# EAGLE design receiver (EAGLE 7.2.0)
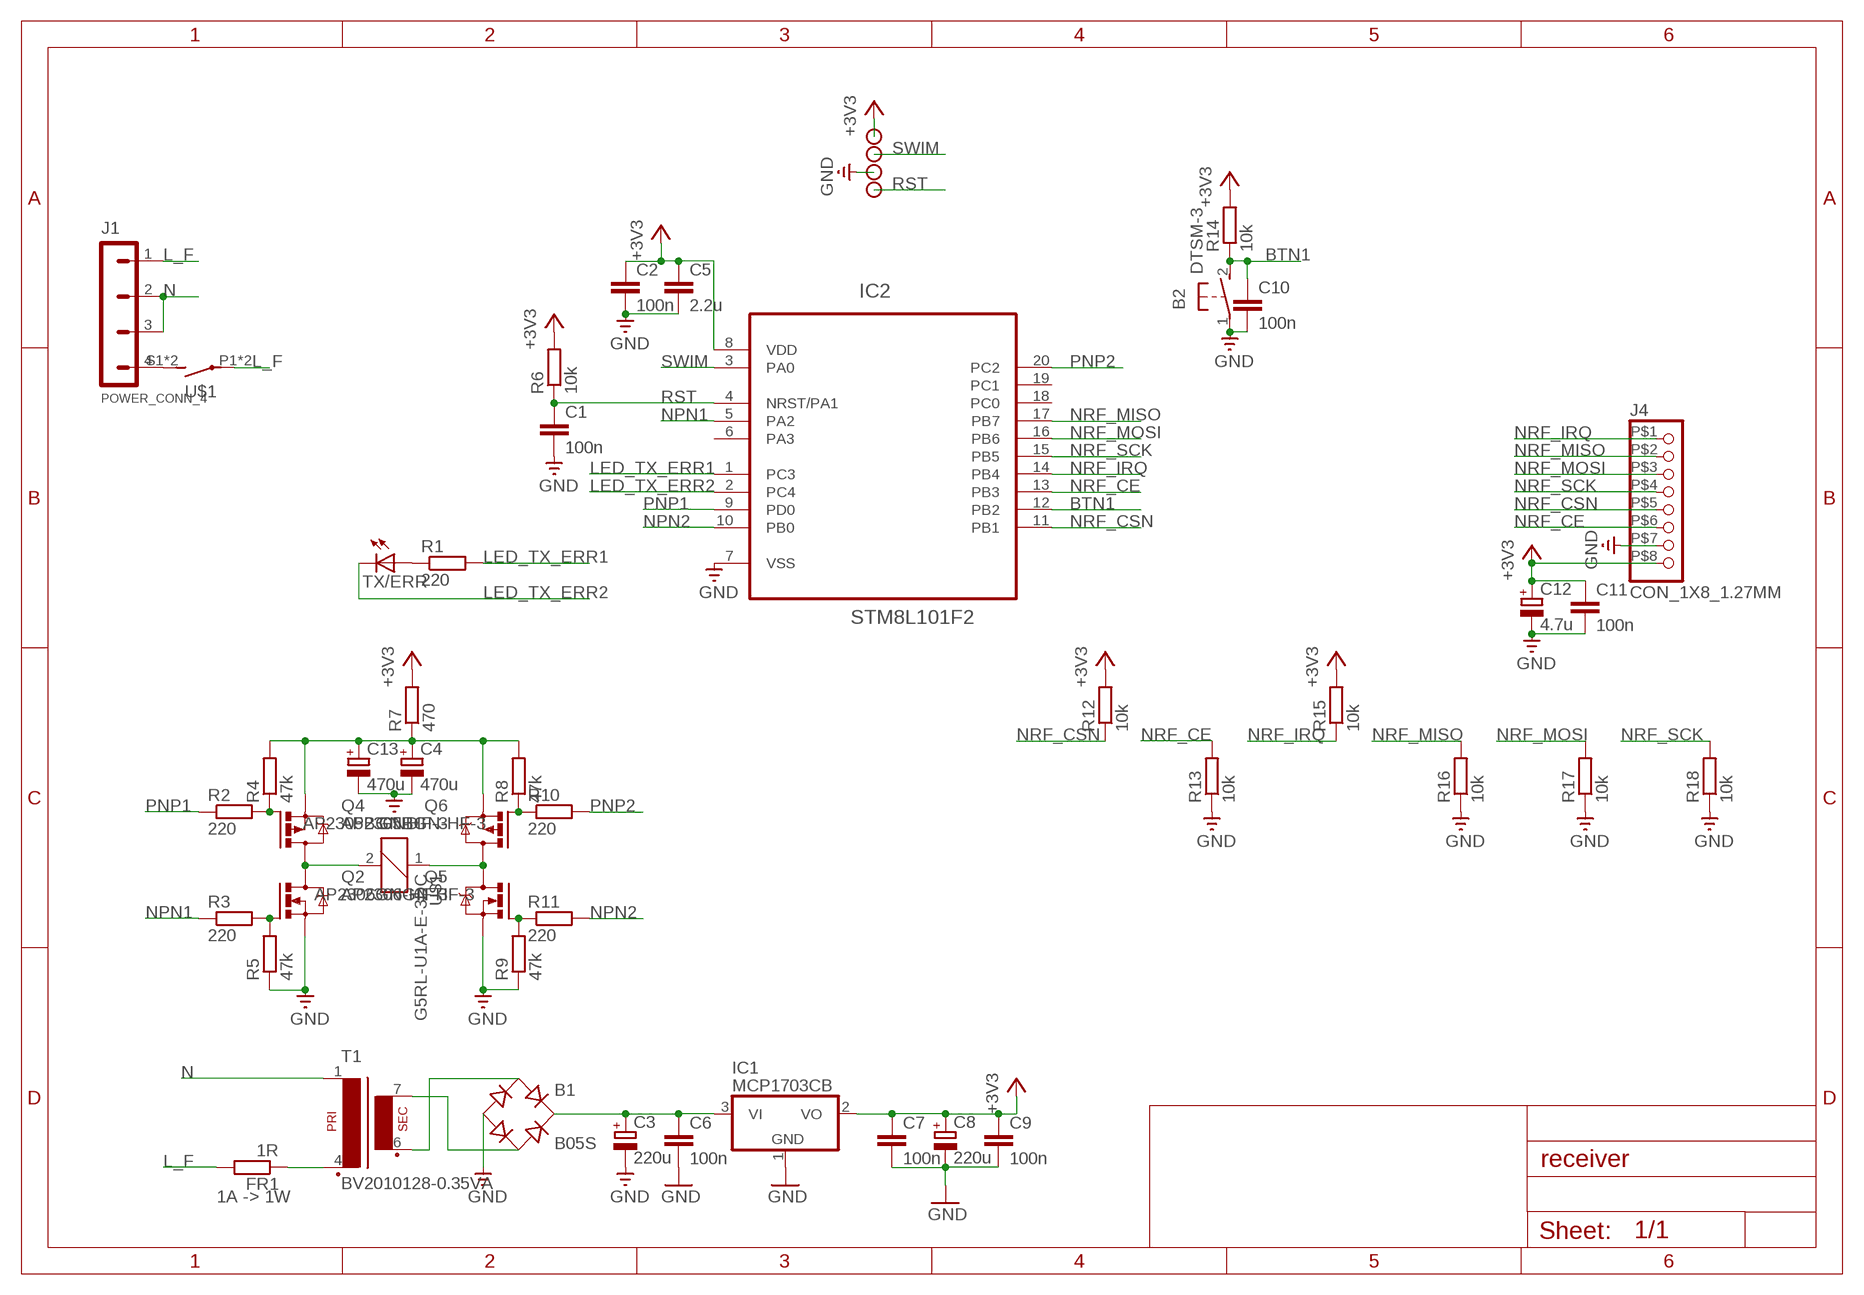
[diagram p0: schematic, sheet 1]

## Parts
B1  B05S  [MBS]
B2  DTSM-3  [DTSM-3]
C1  100n  C-EUC0603K  [C0603K]
C2  100n  C-EUC0603K  [C0603K]
C3  220u  CPOL-EUE3.5-8  [E3,5-8]
C4  470u  CPOL-EUE2.5-6  [E2,5-6]
C5  2.2u  C-EUC0805K  [C0805K]
C6  100n  C-EUC0603K  [C0603K]
C7  100n  C-EUC0603K  [C0603K]
C8  220u  CPOL-EUE2.5-6  [E2,5-6]
C9  100n  C-EUC0603K  [C0603K]
C10  100n  C-EUC0603K  [C0603K]
C11  100n  C-EUC0603K  [C0603K]
C12  4.7u  CPOL-EUSMCA  [SMC_A]
C13  470u  CPOL-EUE2.5-6  [E2,5-6]
FR1  1R  R-EU_0309/10  [0309/10]
IC1  MCP1703CB  [SOT23]
IC2  STM8L101F2  [TSSOP20]
J1  POWER_CONN_4  [TERMINAL_BLOCK_4]
J4  CON_1X8_1.27MM  [CON_1X8PIN_1.27MM]
Q2  AP2306GN-HF-3  [SOT23]
Q4  AP2305BGN-HF-3  [SOT23]
Q5  AP2306GN-HF-3  [SOT23]
Q6  AP2305BGN-HF-3  [SOT23]
R1  220  R-EU_R0603  [R0603]
R2  220  R-EU_R0603  [R0603]
R3  220  R-EU_R0603  [R0603]
R4  47k  R-EU_R0603  [R0603]
R5  47k  R-EU_R0603  [R0603]
R6  10k  R-EU_R0603  [R0603]
R7  470  R-EU_R0603  [R0603]
R8  47k  R-EU_R0603  [R0603]
R9  47k  R-EU_R0603  [R0603]
R10  220  R-EU_R0603  [R0603]
R11  220  R-EU_R0603  [R0603]
R12  10k  R-EU_R0603  [R0603]
R13  10k  R-EU_R0603  [R0603]
R14  10k  R-EU_R0603  [R0603]
R15  10k  R-EU_R0603  [R0603]
R16  10k  R-EU_R0603  [R0603]
R17  10k  R-EU_R0603  [R0603]
R18  10k  R-EU_R0603  [R0603]
SIG_+3V1  CON_PAD  [SMD_PAD]
SIG_GND  CON_PAD  [SMD_PAD]
SIG_RST  CON_PAD  [SMD_PAD]
SIG_SWIM  CON_PAD  [SMD_PAD]
T1  BV2010128-0.35VA  [BV2010128-0.35VA]
TX/ERR  LED3MM  [LED3MM]
U$1  G5RL-U1A-E-3DC  [G5RL-U1A-E-3DC]

## Nets
+3V3: C2.1 C5.1 C7.1 C8.+ C9.1 C11.1 C12.+ IC1.2(VO) IC2.8(VDD) J4.P$8 R6.2 R7.2 R12.2 R14.2 R15.2 SIG_+3V1.P$1
BTN1: B2.2 C10.1 IC2.12(PB2) R14.1
GND: B1.- B2.1 C1.2 C2.2 C3.- C4.- C5.2 C6.2 C7.2 C8.- C9.2 C10.2 C11.2 C12.- C13.- IC1.1(GND) IC2.7(VSS) J4.P$7 Q2.2(S) Q5.2(S) R5.1 R9.1 R13.1 R16.1 R17.1 R18.1 SIG_GND.P$1
L_F: FR1.2 J1.1 U$1.P1(P) U$1.P2(P)
LED_TX_ERR1: IC2.1(PC3) R1.2
LED_TX_ERR2: IC2.2(PC4) TX/ERR.K(C)
N: J1.2 J1.3 T1.1
N$1: J1.4 U$1.S1(S) U$1.S2(S)
N$2: R1.1 TX/ERR.A
N$3: B1.AC2 T1.7(S4)
N$4: B1.+ C3.+ C6.1 IC1.3(VI)
N$8: B1.AC1 T1.6(S3)
N$9: Q2.1(G) R3.2 R5.2
N$10: Q2.3(D) Q4.3(D) U$1.2
N$11: Q5.1(G) R9.2 R11.1
N$12: Q4.1(G) R2.2 R4.1
N$14: Q6.1(G) R8.1 R10.1
N$17: Q5.3(D) Q6.3(D) U$1.1
N$18: C4.+ C13.+ Q4.2(S) Q6.2(S) R4.2 R7.1 R8.2
N$19: FR1.1 T1.4(P2)
NPN1: IC2.5(PA2) R3.1
NPN2: IC2.10(PB0) R11.2
NRF_CE: IC2.13(PB3) J4.P$6 R13.2
NRF_CSN: IC2.11(PB1) J4.P$5 R12.1
NRF_IRQ: IC2.14(PB4) J4.P$1 R15.1
NRF_MISO: IC2.17(PB7) J4.P$2 R16.2
NRF_MOSI: IC2.16(PB6) J4.P$3 R17.2
NRF_SCK: IC2.15(PB5) J4.P$4 R18.2
PNP1: IC2.9(PD0) R2.1
PNP2: IC2.20(PC2) R10.2
RST: C1.1 IC2.4(NRST/PA1) R6.1 SIG_RST.P$1
SWIM: IC2.3(PA0) SIG_SWIM.P$1
Unconnected: IC2.6(PA3) IC2.18(PC0) IC2.19(PC1)

## Notes on the sheet
- 1A -> 1W

## Library data of the parts
B1 = rectifier:B*S: Surface Mount Glass Passivated Bridge Rectifiers Source: Comchip Bridge Rectifiers B05S-G_B10S-G.pdf
B2 = switch-tact:DTSM-3
C1 C2 C5-C7 C9-C11 = resistor:C-EU: CAPACITOR, European symbol
C3 C4 C8 C12 C13 = resistor:CPOL-EU: POLARIZED CAPACITOR, European symbol
FR1 R1-R18 = resistor:R-EU_: RESISTOR, European symbol
IC1 = linear:MCP1703: 250 mA, 16V, Low Quiescent Current LDO Regulator Source: http://ww1.microchip.com/downloads/en/DeviceDoc/22049b.pdf
IC2 = componente_RFSwitch:STM8L101F2
J1 = CarReceiver:POWER_CONN_4
J4 = componente_RFSwitch:CON_1X8_1.27MM
Q2 Q5 = componente_RFSwitch:AP2306GN-HF-3
Q4 Q6 = componente_RFSwitch:AP2305BGN-HF-3
SIG_+3V1 SIG_GND SIG_RST SIG_SWIM = componente_RFSwitch:CON_PAD
T1 = componente_RFSwitch:BV2010128-0.35VA
TX/ERR = led:LED: LED OSRAM: - CHIPLED LG R971, LG N971, LY N971, LG Q971, LY Q971, LO R971, LY R971 LH N974, LH R974 LS Q976, LO Q976, LY Q976 LO Q996 - Hyper CHIPLED LW Q18S LB Q993, LB Q99A, LB R99A - SideLED LS A670, LO A670, LY A670, LG A670, LP A670 LB A673, LV A673, LT A673, LW A673 LH A674 LY A675 LS A676, LA A676, LO A676, LY A676, LW A676 LS A679, LY A679, LG A679 - Hyper Micro SIDELED® LS Y876, LA Y876, LO Y876, LY Y876 LT Y87S - SmartLED LW L88C, LW L88S LB L89C, LB L89S, LG L890 LS L89K, LO L89K, LY L89K LS L896, LA L896, LO L896, LY L896 - TOPLED LS T670, LO T670, LY T670, LG T670, LP T670 LSG T670, LSP T670, LSY T670, LOP T670, LYG T670 LG T671, LOG T671, LSG T671 LB T673, LV T673, LT T673, LW T673 LH T674 LS T676, LA T676, LO T676, LY T676, LB T676, LH T676, LSB T676, LW T676 LB T67C, LV T67C, LT T67C, LS T67K, LO T67K, LY T67K, LW E67C LS E67B, LA E67B, LO E67B, LY E67B, LB E67C, LV E67C, LT E67C LW T67C LS T679, LY T679, LG T679 LS T770, LO T770, LY T770, LG T770, LP T770 LB T773, LV T773, LT T773, LW T773 LH T774 LS E675, LA E675, LY E675, LS T675 LS T776, LA T776, LO T776, LY T776, LB T776 LHGB T686 LT T68C, LB T68C - Hyper Mini TOPLED® LB M676 - Mini TOPLED Santana® LG M470 LS M47K, LO M47K, LY M47K Source: http://www.osram.convergy.de LUXEON: - LUMILED® LXK2-PW12-R00, LXK2-PW12-S00, LXK2-PW14-U00, LXK2-PW14-V00 LXK2-PM12-R00, LXK2-PM12-S00, LXK2-PM14-U00 LXK2-PE12-Q00, LXK2-PE12-R00, LXK2-PE12-S00, LXK2-PE14-T00, LXK2-PE14-U00 LXK2-PB12-K00, LXK2-PB12-L00, LXK2-PB12-M00, LXK2-PB14-N00, LXK2-PB14-P00, LXK2-PB14-Q00 LXK2-PR12-L00, LXK2-PR12-M00, LXK2-PR14-Q00, LXK2-PR14-R00 LXK2-PD12-Q00, LXK2-PD12-R00, LXK2-PD12-S00 LXK2-PH12-R00, LXK2-PH12-S00 LXK2-PL12-P00, LXK2-PL12-Q00, LXK2-PL12-R00 Source: www.luxeon.com KINGBRIGHT: KA-3528ASYC Source: www.kingbright.com
U$1 = componente_RFSwitch:G5RL-U1A-E-3DC

## Board
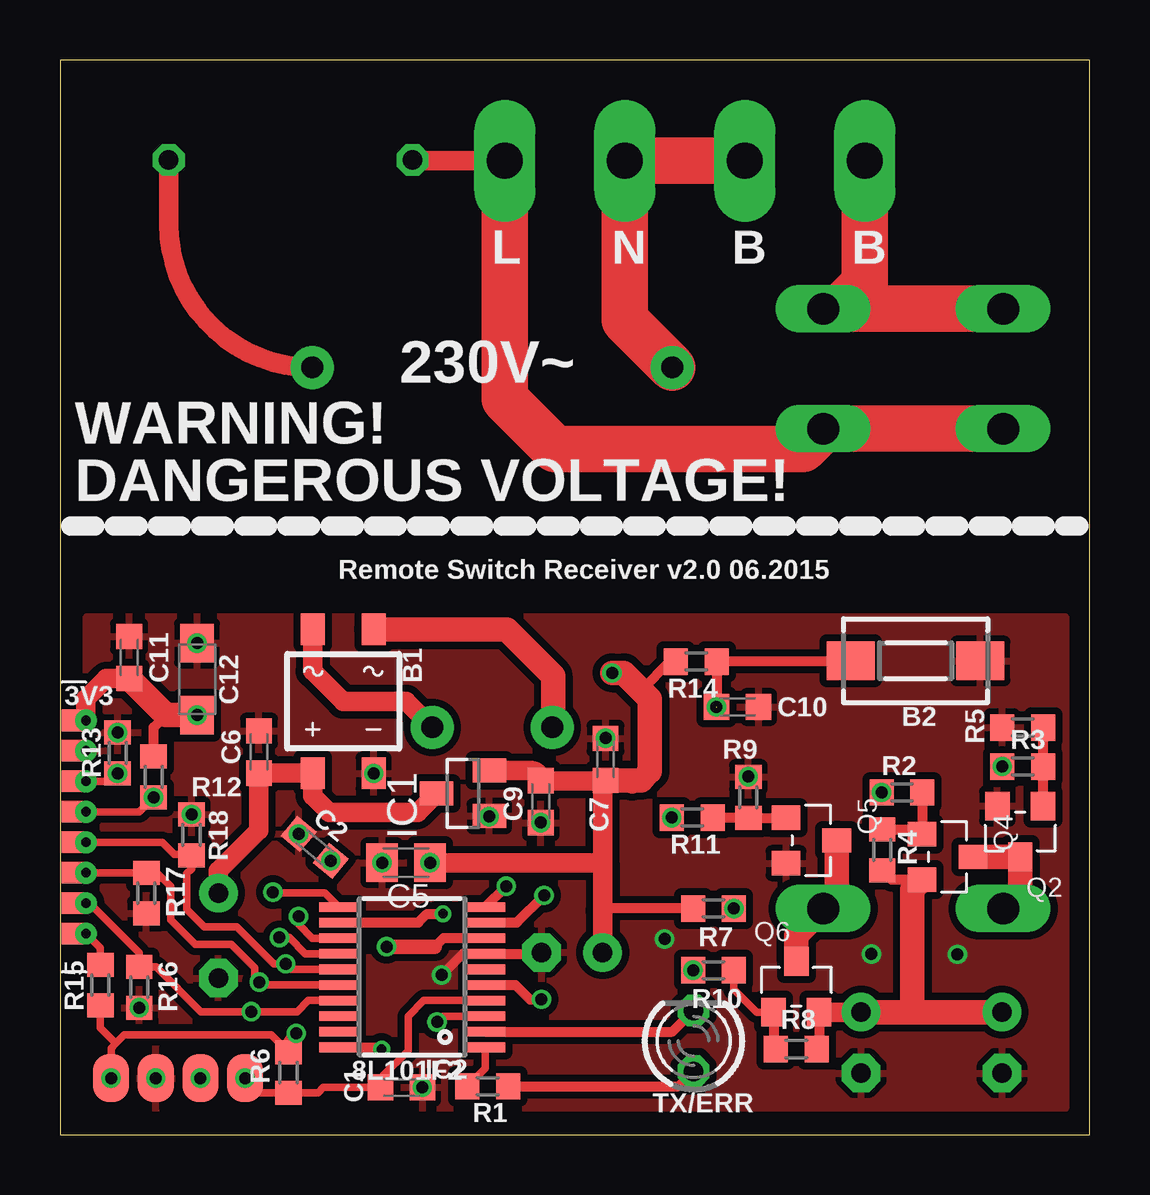
[diagram p1: board, top side]
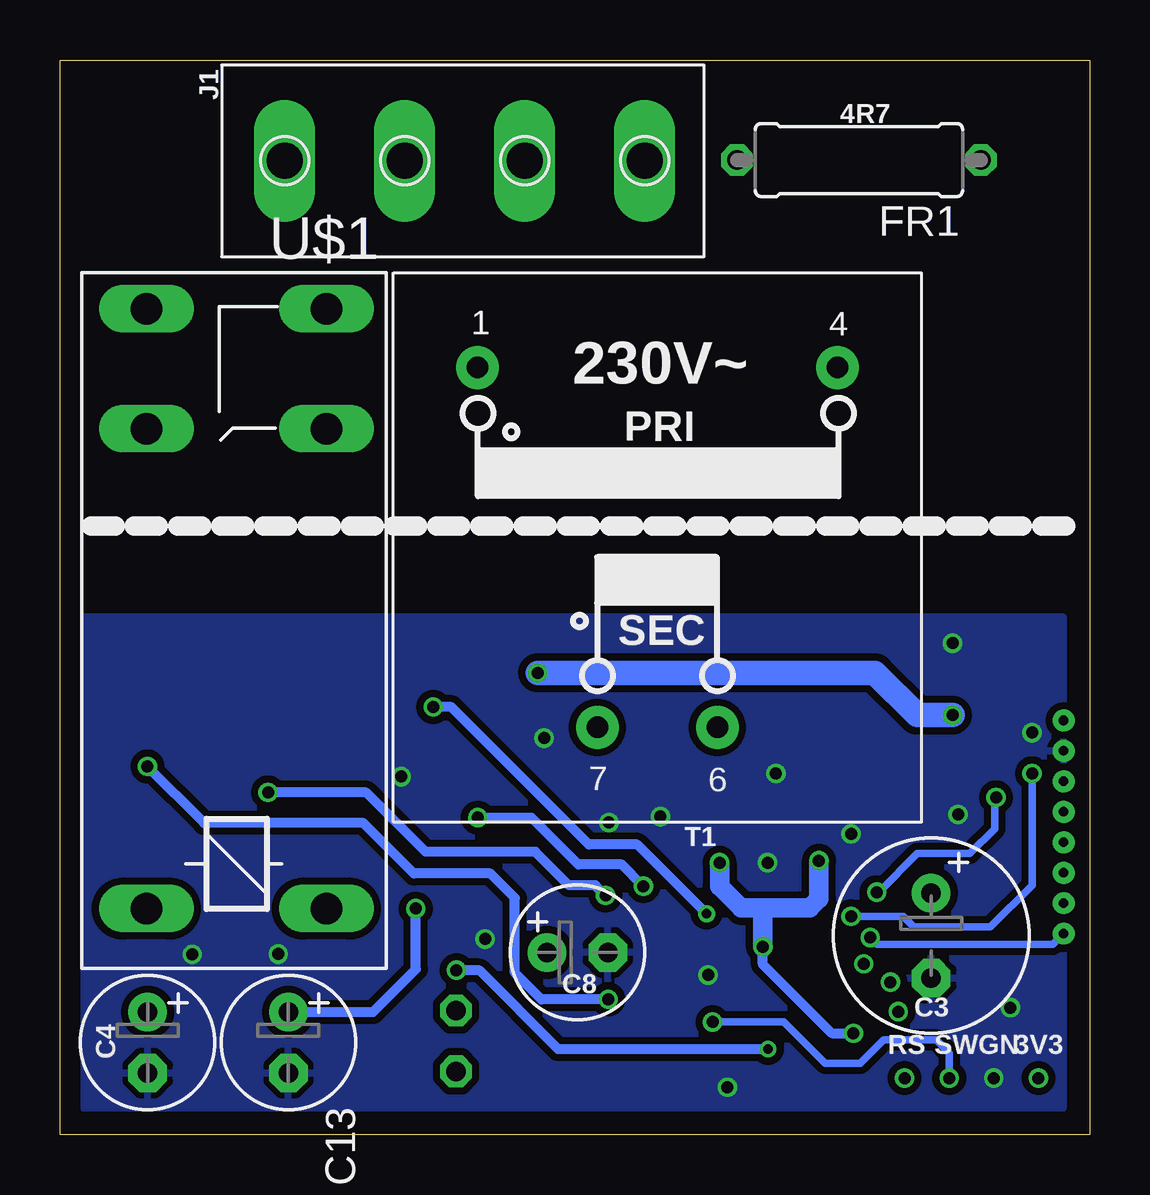
[diagram p2: board, bottom side, seen from below]

Size 42.9 x 44.8 mm. Coordinates in mm from the lower left corner, seen from the top.
Outline: 0,44.8 0,0 42.9,0 42.9,44.8 0,44.8
Copper layers (1*16): Top 0.035mm / dielectric 1.5mm / Bottom 0.035mm
Design rules "SeeedStudio_2layer_DRU_no_angle_20140221": minimum track width 6mil, minimum drill 12mil, track to track 6mil, track to pad 6mil, pad to pad 6mil, via to via 6mil, smd to smd 0mil, copper to edge 10mil, drill to drill 10mil, minimum pad ring 10mil, minimum via ring 6mil, stop-mask expansion 2mil, vias tented up to drill 100mil, thermal gap 10mil

### Footprints (pad centres in the part's own frame; a part is rotated, then mirrored left to right if it is on the bottom)
MBS = smd 1 x 1.3: + -1.27,-3; - 1.27,-3; AC1 -1.27,3; AC2 1.27,3
DTSM-3 = smd 2 x 1.6: 1 -2.7,0; 2 2.7,0
C0603K = smd 1.05 x 1.08: 1 -0.875,0; 2 0.875,0
E3,5-8 = drill 0.813 pad 1.6: + -1.778,0 | drill 0.813 pad 1.6 octagon: - 1.778,0
E2,5-6 = drill 0.813 pad 1.6: + -1.27,0 | drill 0.813 pad 1.6 octagon: - 1.27,0
C0805K = smd 1.3 x 1.6: 1 -1,0; 2 1,0
SMC_A = smd 1.6 x 1.4: + -1.5,0; - 1.5,0
0309/10 = drill 0.813 octagon: 1 -5.08,0; 2 5.08,0
SOT23 = smd 1 x 1.4: 1 -0.95,-1.1; 2 0.95,-1.1; 3 0,1.1
TSSOP20 = smd 0.4 x 1.65: 1 -3.575,-3.05; 2 -2.925,-3.05; 3 -2.275,-3.05; 4 -1.625,-3.05; 5 -0.975,-3.05; 6 -0.325,-3.05; 7 0.325,-3.05; 8 0.975,-3.05; 9 1.625,-3.05; 10 2.275,-3.05; 11 2.275,3.05; 12 1.625,3.05; 13 0.975,3.05; 14 0.325,3.05; 15 -0.325,3.05; 16 -0.975,3.05; 17 -1.625,3.05; 18 -2.275,3.05; 19 -2.925,3.05; 20 -3.575,3.05
TERMINAL_BLOCK_4 = drill 1.5 pad 2.54 long: 1 0,7.58; 2 0,2.58; 3 0,-2.42; 4 0,-7.42
CON_1X8PIN_1.27MM = drill 0.4: P$1 0,0; P$2 0,-1.27; P$3 0,-2.54; P$4 0,-3.81; P$5 0,-5.08; P$6 0,-6.35; P$7 0,-7.62; P$8 0,-8.89 | smd 1 x 0.9: P$9 0.5,0; P$10 0.5,-1.27; P$11 0.5,-2.54; P$12 0.5,-3.81; P$13 0.5,-5.08; P$14 0.5,-6.35; P$15 0.5,-7.62; P$16 0.5,-8.89
SOT23' = smd 1.016 x 1.2: 1 -0.95,-1.06; 2 0.95,-1.06; 3 0,1.06
R0603 = smd 1 x 1.1: 1 -0.85,0; 2 0.85,0
SMD_PAD = smd 2 x 1.5: P$1 0,0
BV2010128-0.35VA = drill 0.9 pad 1.778: 1 -7.5,7.5; 4 7.5,7.5; 6 2.5,-7.5; 7 -2.5,-7.5
LED3MM = drill 0.813 octagon: A -1.27,0; K 1.27,0
G5RL-U1A-E-3DC = drill 1.321 long: 1 -13.27,-3.85; 2 -13.27,3.65; P1 6.73,3.65; P2 6.73,-3.85; S1 11.73,3.65; S2 11.73,-3.85

### Placement (x,y rotation side)
B1  11.8,18.07 0 top
B2  35.65,19.75 180 top
C1  14.23,1.97 0 top
C2  10.61,11.98 140 top
C3  6.6,8.3 270 bottom
C4  39.25,3.84 270 bottom
C5  14.42,11.34 180 top
C6  8.29,15.95 90 top
C7  22.73,15.64 90 top
C8  21.34,7.6 0 bottom
C9  20.03,13.88 270 top
C10  28.23,17.83 0 top
C11  2.88,19.89 90 top
C12  5.71,18.99 90 top
C13  33.38,3.84 270 bottom
FR1  9.61,40.63 180 bottom
IC1  16.79,14.23 90 top
IC2  14.67,7.22 90 top
J1  26.12,40.6 270 bottom
J4  1.08,8.38 180 top
Q2  AP2306GN-HF-3  [SOT23']  40.01,12.64 180 top
Q4  AP2305BGN-HF-3  [SOT23']  36.98,11.58 270 top
Q5  AP2306GN-HF-3  [SOT23']  31.31,12.27 270 top
Q6  AP2305BGN-HF-3  [SOT23']  30.68,6.17 0 top
R1  17.82,2.02 180 top
R2  35.08,14.27 0 top
R3  40.11,15.35 0 top
R4  34.26,11.87 270 top
R5  40.11,16.97 0 top
R6  9.52,2.59 90 top
R7  27.23,9.43 180 top
R8  30.68,3.57 0 top
R9  28.68,14.06 270 top
R10  27.23,6.86 180 top
R11  26.34,13.22 180 top
R12  3.9,14.91 90 top
R13  2.4,15.91 270 top
R14  26.51,19.72 180 top
R15  1.68,6.24 270 top
R16  3.3,6.15 90 top
R17  3.6,10.07 90 top
R18  5.48,12.5 270 top
SIG_+3V1  2.13,2.36 270 top
SIG_GND  3.99,2.36 90 top
SIG_RST  7.71,2.36 270 top
SIG_SWIM  5.85,2.36 270 top
T1  18.01,24.48 0 bottom
TX/ERR  26.4,3.91 90 top
U$1  35.65,22.7 90 bottom

### Tracks (layer width: path | path; a pad name or v marks a point on that pad's centre or on a via)
+3V3  (via drill 0.5)  (1 unrouted)
  Top 0.305: R6.2 8.8,4.16 2.68,4.16 2.33,3.81 | 2.33,3.81 2.13,3.61 SIG_+3V1.P$1 | R15.2 1.68,4.46 2.33,3.81
  Top 0.406: v9.84,4.23 9.52,3.91 R6.2 | R12.2 3.9,16.98 4.41,17.49 | 23.49,19.25 23.6,19.25 | R14.2 25.41,19.72 24.21,18.52 | IC2.8 15.97,8.2 15.62,7.84 | R7.2 22.69,9.43 arc90 22.61,9.35
  Top 0.61: 15.62,7.84 v13.61,7.84
  Top 0.813: J4.P$8 1.08,18.16 1.93,19.01 C11.1 | 23.84,14.63 23.98,14.77 | IC1.2 19.61,15.18 arc-90 C9.1 22.72,14.76 C7.1 22.61,14.64 22.61,11.34 | C5.1 22.61,11.34 | 22.61,11.34 22.61,9.35 C8.+
  Top 1.016: v23,19.25 23.49,19.25 24.21,18.52 24.58,18.16 24.58,15.14 24.21,14.77 23.98,14.77 C7.1 | C12.+ 4.41,17.49 C11.1
  Bottom 0.406: v9.84,4.23 10.74,4.23 13.61,7.1 v13.61,7.84
  Bottom 0.813: C5.1 15.42,10.36 14.51,9.45 13.47,9.45 | 13.47,9.45 11.66,9.45 11.28,9.83 C2.1 | v13.61,7.84 13.61,9.31 13.47,9.45
  Bottom 1.016: v23,19.25 8.95,19.25 7.19,17.49 C12.+
  other vias: 2.13,2.36 5.71,17.49 11.28,11.42 15.42,11.34
BTN1  (via drill 0.4, 0.5)  (1 unrouted)
  Top 0.406: C10.1 R14.1 32.92,19.72 B2.2 | IC2.12 14.94,8.85 15.29,9.2 v15.95,9.2 v15.96,9.21
  Bottom 0.406: v27.35,17.83 26.59,17.83 20.86,12.1 18.85,12.1 v15.96,9.21
GND  (via drill 0.5)  (1 unrouted)
  Top 0.406: v15.9,6.66 16.79,7.54 IC2.7 20.07,7.54 arc90 20.08,7.55
  other vias: 28.68,14.93 3.99,2.36 13.07,15.06 17.88,13.26 15.09,1.98 5.71,20.49 20.03,13.01 9.94,12.54 2.4,16.76 5.48,13.35 3.3,5.3 22.73,16.53 13.42,11.34 25.19,8.16 33.81,7.53 37.39,7.52
  pour Top (isolate 0.3): 1.1,21.6 41.9,21.6 41.9,1.1 1.1,1.1
  pour Bottom (isolate 0.3): 1.1,1.1 41.9,1.1 41.9,21.6 1.1,21.6
L_F
  Top 0.813: J1.1 14.72,40.6 arc-90 FR1.2
  Top 1.93: U$1.P1 U$1.P2 30.95,28.58 20.62,28.58 18.54,30.66 J1.1
LED_TX_ERR1
  Top 0.305: IC2.1 17.72,2.77 R1.2
LED_TX_ERR2
  Top 0.406: IC2.2 25.52,4.29 TX/ERR.K
N
  Top 1.93: T1.1 23.54,33.95 J1.2 J1.3
N$1
  Top 1.93: U$1.S1 32.49,34.43 | 32.49,34.43 U$1.S2 | J1.4 33.54,35.48 32.49,34.43
N$2
  Top 0.406: R1.1 25.78,2.02 TX/ERR.A
N$3
  Top 1.016: B1.AC2 18.61,21.07 20.55,19.13 20.55,17.02 T1.7
N$4
  Top 0.813: C3.+ 6.6,11 8.28,12.68 C6.1 B1.+ 10.53,14.13 11.22,13.44 14.9,13.44 IC1.3
N$8
  Top 0.813: B1.AC1 10.53,19.33 11.8,18.06 14.43,18.06 T1.6
N$9
  Top 0.406: Q2.1 R3.2 R5.2
N$10
  Top 1.016: Q4.3 Q2.3 40.01,10.14 U$1.2
N$11
  Top 0.406: R11.1 R9.2 Q5.1
N$12
  Top 0.406: R2.2 Q4.1 35.73,12.72 R4.1
N$14
  Top 0.305: R10.1 28.08,6.06 29.03,5.11 Q6.1
  Top 0.406: Q6.1 29.73,3.67 R8.1
N$17
  Top 1.016: Q6.3 30.68,8.31 U$1.1 32.37,10 Q5.3
N$18  (via drill 0.5)
  Top 0.406: Q6.2 31.63,3.67 R8.2 | Q4.2 34.65,10.63 R4.2
  Top 0.813: 35.92,5.14 35.89,5.11 | Q6.2 C13.+
  Top 1.016: C4.+ 35.89,5.11 35.51,5.11 | 35.51,5.11 C13.+ | Q4.2 35.51,10.22 35.51,5.11
  Bottom 0.406: C13.+ 29.86,5.11 28.07,6.9 R7.1
  other vias: 28.08,9.43
N$19
  Top 0.813: FR1.1 4.53,37.96 arc90 T1.4
NPN1  (via drill 0.5)
  Top 0.406: IC2.5 18.98,6.25 19.58,5.64 v20.06,5.64
  Bottom 0.406: v20.06,5.64 22.84,5.64 23.95,6.75 23.95,9.87 24.97,10.89 28.16,10.89 30.26,12.99 36.9,12.99 R3.1
  other vias: 39.26,15.35
NPN2  (via drill 0.5)
  Top 0.406: IC2.10 v18.59,10.36
  Bottom 0.406: v18.59,10.36 19.49,11.26 21.3,11.26 23.25,13.21 R11.2
  other vias: 25.49,13.22
NRF_CE  (via drill 0.5)
  Top 0.305: IC2.13 10.51,8.2 9.94,8.76 v9.94,9.1 | J4.P$6 2.07,14.73 R13.2
  Bottom 0.305: v9.94,9.1 7.77,9.1 7.33,8.66 4.14,8.66 2.4,10.4 R13.2
  other vias: 2.4,15.06
NRF_CSN  (via drill 0.5)
  Top 0.305: IC2.11 | IC2.11 11.62,9.53 | J4.P$5 3.3,13.46 R12.1 | IC2.11 11.03,10.09 9.11,10.09 v8.87,10.11
  Bottom 0.305: v8.87,10.11 8.79,10.11 7.18,11.72 4.99,11.72 3.96,12.75 3.96,14 R12.1
  other vias: 3.9,14.06
NRF_IRQ  (via drill 0.5)
  Top 0.305: J4.P$1 1.68,7.78 R15.1 | IC2.14 10.22,7.54 9.55,8.22 v9.14,8.22
  Bottom 0.305: J4.P$1 1.53,7.93 8.85,7.93 v9.14,8.22
NRF_MISO  (via drill 0.5)
  Top 0.305: J4.P$2 1.23,9.65 3.3,7.58 R16.2 4,7 5.87,5.13 v7.97,5.13 9.88,5.13 10.35,5.59 IC2.17
NRF_MOSI  (via drill 0.5)
  Top 0.305: IC2.16 8.41,6.25 v8.3,6.36 8.11,6.55 8.11,6.96 7.13,7.94 5.63,7.94 4.61,8.96 4.61,10.35 4.04,10.92 R17.2 J4.P$3
NRF_SCK  (via drill 0.5)
  Top 0.305: IC2.15 | IC2.15 | IC2.15 9.63,6.89 v9.41,7.12 8.9,7.12 7.36,8.66 6.02,8.66 5.28,9.4 5.28,10.89 5.48,11.09 R18.2 5.45,11.68 4.77,11.68 4.26,12.19 J4.P$4
PNP1  (via drill 0.5)
  Top 0.305: IC2.9 arc90 IC2.9
  Top 0.406: IC2.9 19.04,8.85 v20.17,9.98
  Bottom 0.406: R2.1 30.14,14.26 27.67,11.79 23.09,11.79 21.7,10.4 20.59,10.4 v20.17,9.98
  other vias: 34.23,14.27
PNP2  (via drill 0.4, 0.5)
  Top 0.406: IC2.20 13.32,3.65 v13.4,3.57
  Bottom 0.406: v13.4,3.57 22.14,3.57 25.42,6.85 R10.2
  other vias: 26.38,6.86
RST  (via drill 0.5)
  Top 0.305: IC2.4 15.15,5.59 14.5,4.94 14.5,3.5 13.47,2.47 13.47,2.08 C1.1 10.97,1.97 10.75,1.75 R6.1 8.33,1.74 SIG_RST.P$1
  other vias: 7.71,2.36
SWIM  (via drill 0.5)
  Top 0.305: IC2.3 15.96,4.95 v15.71,4.7 | 5.85,2.72 SIG_SWIM.P$1
  Bottom 0.305: v15.71,4.7 12.74,4.7 11.01,2.97 9.55,2.97 8.57,3.95 6.4,3.95 5.85,3.4 SIG_SWIM.P$1
  other vias: 5.85,2.36

### Text on the board
tPlace: L | N | B | B | 230V~ | WARNING! | DANGEROUS VOLTAGE! | Remote Switch Receiver v2.0 06.2015 | 3V3 | 8L101F2
bPlace: 4R7 | 230V~ | 3V3 | GN | SW | RS